# Altium schematic sheet TopLevel.SchDoc: Наименование
size 594 x 420 mm; CheckedBy: Дойников; Author: Михайловский; SheetNumber: 1; SheetTotal: 1; PageSetup: Record=PageOptions|CenterHorizontal=True|CenterVertical=True|PrintScale=0.94|XCorrection=1.00|YCorrection=1.00|PrintKind=1|BorderSize=5000000|LeftOffset=0|BottomOffset=0|Orientation=1|PaperLength=1000|PaperWidth=1000|Scale=100|PaperSource=7|PrintQuality=-4|MediaType=1|DitherType=10|PaperKind=A4|PrintScaleMode=1; MainDevice: Перв.примен.; Name: TopLevel; DocumentName: Sheet1.SCHDOC
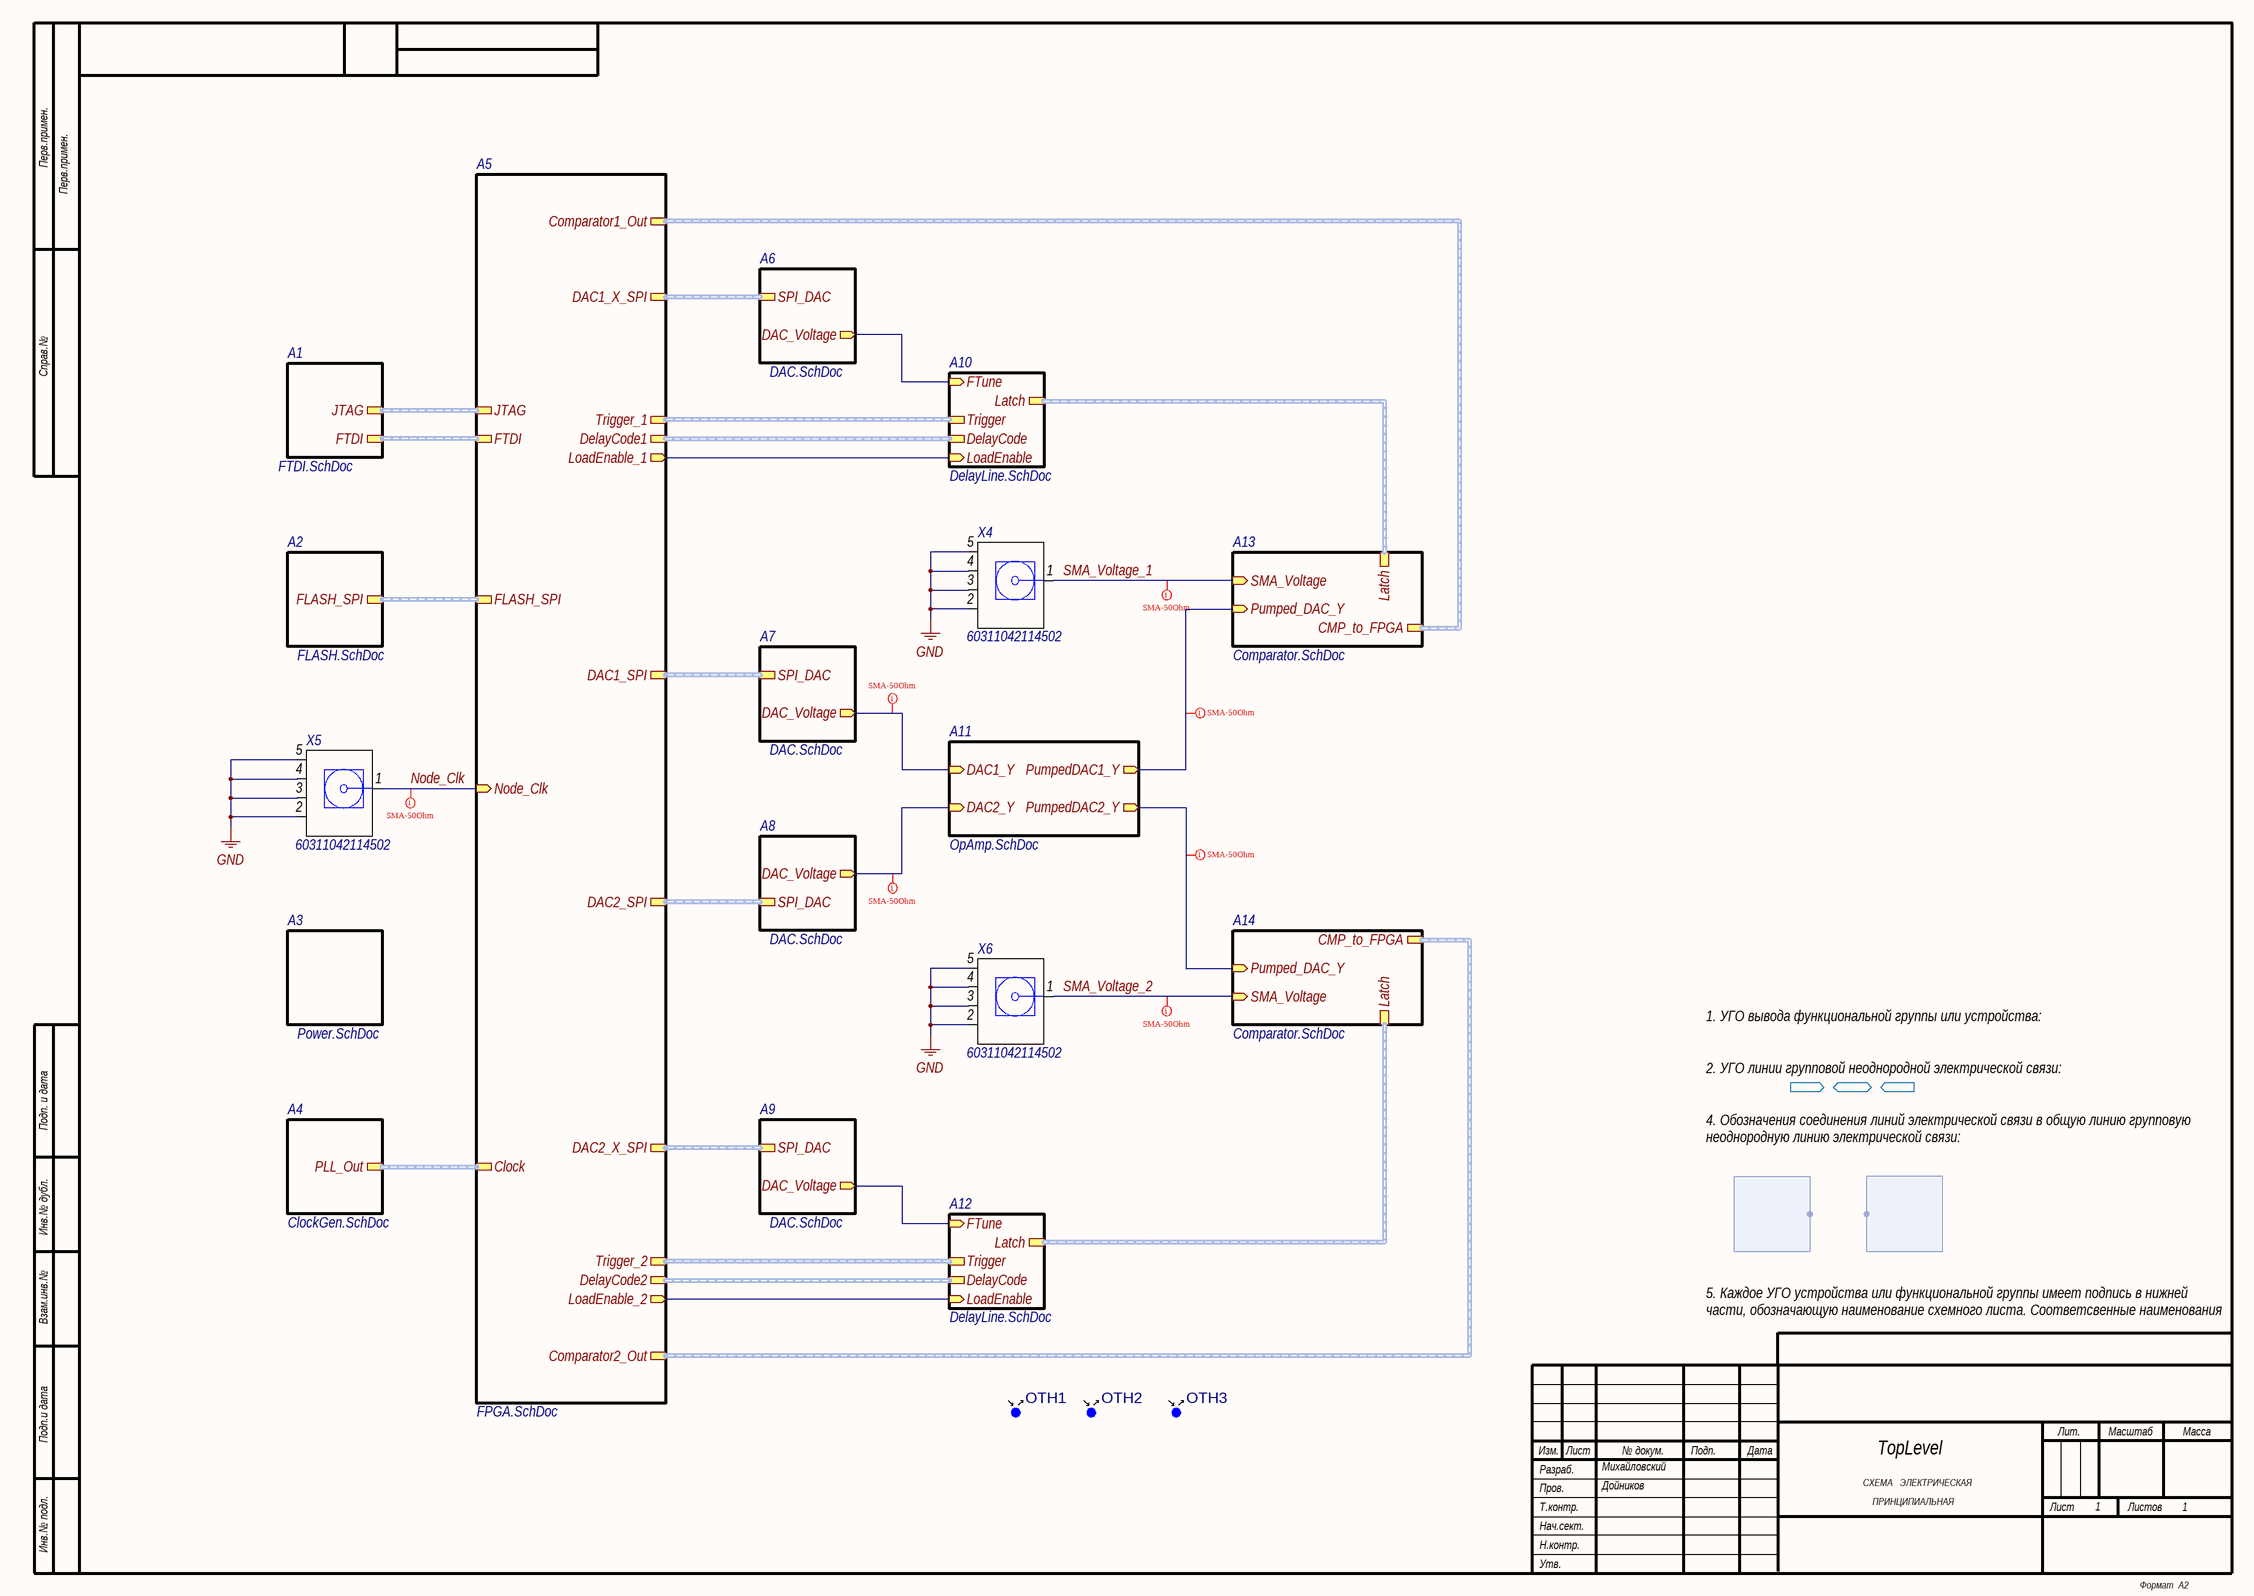
[diagram p0: TopLevel.SchDoc]

## Parts
OTH1  REPER_D1.0MM  [REPER_D1.0MM]  (value not drawn)  (no BOM)
OTH2  REPER_D1.0MM  [REPER_D1.0MM]  (value not drawn)  (no BOM)
OTH3  REPER_D1.0MM  [REPER_D1.0MM]  (value not drawn)  (no BOM)
X4  (no value)  [60311042114502]
X5  (no value)  [60311042114502]
X6  (no value)  [60311042114502]

## Sub-sheets
A1 = FTDI.SchDoc: JTAG (harness JTAG), FTDI (harness FTDI_UART_SPI)
A2 = FLASH.SchDoc: FLASH_SPI (harness SPI)
A3 = Power.SchDoc: no entries
A4 = ClockGen.SchDoc: PLL_Out (harness Diff_Pair)
A5 = FPGA.SchDoc: JTAG (harness JTAG), FLASH_SPI (harness SPI), Trigger_1 (harness Signal), Trigger_2 (harness Signal), DAC2_SPI (harness SPI), DAC1_SPI (harness SPI), DelayCode1 (harness DelayCode), DelayCode2 (harness DelayCode), Comparator2_Out (harness Signal), Comparator1_Out (harness Signal), LoadEnable_2 (out), LoadEnable_1 (out), FTDI (harness FTDI_UART_SPI), DAC2_X_SPI (harness SPI), DAC1_X_SPI (harness SPI), Node_Clk (in), Clock (harness Diff_Pair)
A6 = DAC.SchDoc: SPI_DAC (harness SPI), DAC_Voltage (out)
A7 = DAC.SchDoc: SPI_DAC (harness SPI), DAC_Voltage (out)
A8 = DAC.SchDoc: SPI_DAC (harness SPI), DAC_Voltage (out)
A9 = DAC.SchDoc: SPI_DAC (harness SPI), DAC_Voltage (out)
A10 = DelayLine.SchDoc: Trigger (harness Signal), Latch (harness Signal), DelayCode (harness DelayCode), LoadEnable (in), FTune (in)
A11 = OpAmp.SchDoc: PumpedDAC2_Y (out), DAC1_Y (in), DAC2_Y (in), PumpedDAC1_Y (out)
A12 = DelayLine.SchDoc: Trigger (harness Signal), Latch (harness Signal), DelayCode (harness DelayCode), LoadEnable (in), FTune (in)
A13 = Comparator.SchDoc: Latch (harness Signal), CMP_to_FPGA (harness Signal), Pumped_DAC_Y (in), SMA_Voltage (in)
A14 = Comparator.SchDoc: Latch (harness Signal), CMP_to_FPGA (harness Signal), Pumped_DAC_Y (in), SMA_Voltage (in)

## Harnesses
*: 

## Nets
GND: X4.2(GND) X4.3(GND) X4.4(GND) X4.5(GND) X5.2(GND) X5.3(GND) X5.4(GND) X5.5(GND) X6.2(GND) X6.3(GND) X6.4(GND) X6.5(GND)
Node_Clk: X5.1(Signal) ; sheet A5/Node_Clk
SMA_Voltage_1: X4.1(Signal) ; sheet A13/SMA_Voltage
SMA_Voltage_2: X6.1(Signal) ; sheet A14/SMA_Voltage
(unnamed): sheet A5/LoadEnable_2, sheet A12/LoadEnable
(unnamed): sheet A5/LoadEnable_1, sheet A10/LoadEnable
(unnamed): sheet A7/DAC_Voltage, sheet A11/DAC1_Y
(unnamed): sheet A13/Pumped_DAC_Y, sheet A11/PumpedDAC1_Y
(unnamed): sheet A10/FTune, sheet A6/DAC_Voltage
(unnamed): sheet A8/DAC_Voltage, sheet A11/DAC2_Y
(unnamed): sheet A12/FTune, sheet A9/DAC_Voltage
(unnamed): sheet A14/Pumped_DAC_Y, sheet A11/PumpedDAC2_Y

## Buses and harness runs
harness sheet A1/FTDI = sheet A5/FTDI
harness sheet A1/JTAG = sheet A5/JTAG
harness sheet A2/FLASH_SPI = sheet A5/FLASH_SPI
harness sheet A4/PLL_Out = sheet A5/Clock
harness sheet A5/Comparator1_Out = sheet A13/CMP_to_FPGA
harness sheet A5/Comparator2_Out = sheet A14/CMP_to_FPGA
harness sheet A5/DAC1_SPI = sheet A7/SPI_DAC
harness sheet A5/DAC1_X_SPI = sheet A6/SPI_DAC
harness sheet A5/DAC2_SPI = sheet A8/SPI_DAC
harness sheet A5/DAC2_X_SPI = sheet A9/SPI_DAC
harness sheet A5/DelayCode1 = sheet A10/DelayCode
harness sheet A5/DelayCode2 = sheet A12/DelayCode
harness sheet A5/Trigger_1 = sheet A10/Trigger
harness sheet A5/Trigger_2 = sheet A12/Trigger
harness sheet A10/Latch = sheet A13/Latch
harness sheet A12/Latch = sheet A14/Latch

## Layout directives
net class Channel_SMA: (no net found under the mark), Node_Clk, SMA_Voltage_1, SMA_Voltage_2

## Notes on the sheet
- 1. УГО вывода функциональной группы или устройства:
  2. УГО линии групповой неоднородной электрической связи:
  4. Обозначения соединения линий электрической связи в общую линию групповую неоднородную линию электрической связи:
  5. Каждое УГО устройства или функциональной группы имеет подпись в нижней части, обозначающую наименование схемного листа. Соответсвенные наименования схемных листов приведены на нижнем поле каждого листа.
  6. УГО экземпляров функциональных групп выполнены сплошной линией.
- Перв.примен.
- Справ.№
- Подп. и дата
- Инв.№ дубл.
- Взам.инв.№
- Подп.и дата
- Разраб.
- Изм.
- Лист
- № докум.
- Подп.
- Дата
- Лит.
- Масштаб
- Масса
- Т.контр.
- Пров.
- ПРИНЦИПИАЛЬНАЯ
- СХЕМА   ЭЛЕКТРИЧЕСКАЯ
- Листов
- Инв.№ подл.
- Утв.
- Н.контр.
- Нач.сект.
- Формат  A2

## Library data of the parts
OTH1-OTH3 = REPER_D1.0MM: MntType: SMD; MSL: MSL 1; RoHS: Comply; BOMDescription: SMD; CFootprint: =Footprint; PART NUMBER: REPER_D1.0MM; CLASSNAME: Reper; COMPONENTLINK1DESCRIPTION: Datasheet; BOMDESCRIPTIONRUS: =PartTypeRUS+' '+MPN
X4-X6 = SMA_WR_60311042114502: MANUFACTURER: WE; MNTTYPE: SMD; PART NUMBER: SMA_WR_60311042114502; MPN: 60311042114502; MSL: MSL 1; ROHS: Comply; PARTTYPE: SMA; PINS: 5; BOMDESCRIPTION: =MntType+' '+PartType+' '+Package+' '+Value+' '+Tolerance+' '+Voltage+' '+TempCoeff+' '+MPN; CFOOTPRINT: =Footprint; CLASSNAME: SMA; COMPONENTLINK1DESCRIPTION: Datasheet; COMPONENTLINK1URL: https://katalog.we-online.de/em/datasheet/60311042114502.pdf